# Altium schematic sheet Power Blocks Diagram.SchDoc: POWER BLOCKS DIAGRAM
size A4; DrawnBy: ThanhQuoc; Revision: V01; SheetNumber: 2; SheetTotal: 4; Project: RV1126 CAMERA BOARD DESIGN
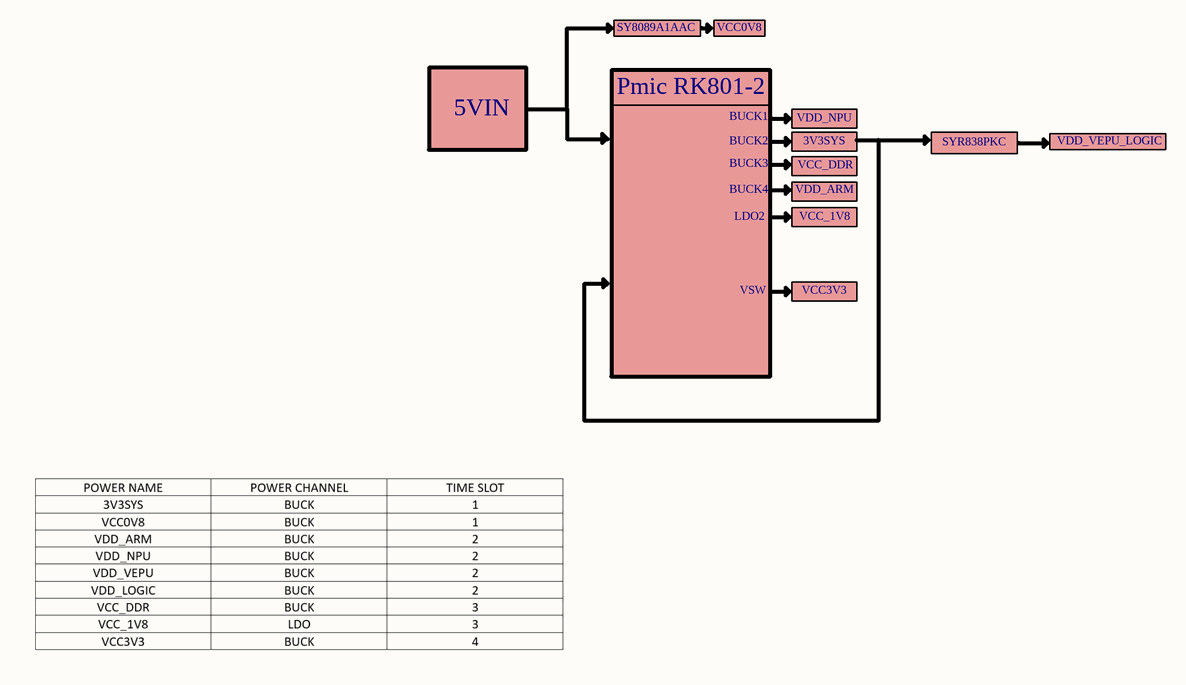
[diagram p0: Power Blocks Diagram.SchDoc]

## Notes on the sheet
- SY8089A1AAC
- VCC0V8
- 5VIN
- Pmic RK801-2
- BUCK1
- BUCK2
- VDD_NPU
- 3V3SYS
- SYR838PKC
- VDD_VEPU_LOGIC
- BUCK3
- BUCK4
- VDD_ARM
- VCC_DDR
- LDO2
- VCC_1V8
- VSW
- VCC3V3
- Title:
- Drawn By:
- Page Contents:
- Checked By:
- Size:
- Date:
- File:
- License:
- Email:
- A4
- nguyenthanhquoc0206@gmail.com
- Number:
- Time:
- Revision:
- Sheet
- Website:
- of
- https://www.facebook.com/ntq.687